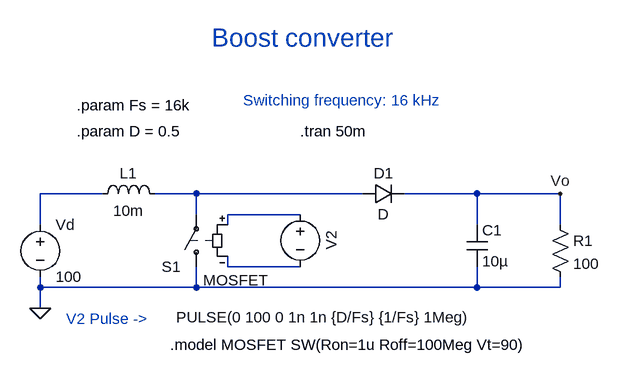
[diagram p0: schematic Boost-converter-1.asc]
Boost-converter-1.asc, the LTspice schematic file:
Version 4.1
SHEET 1 1244 680
WIRE -80 96 -176 96
WIRE 64 96 0 96
WIRE 320 96 64 96
WIRE 496 96 384 96
WIRE 624 96 496 96
WIRE 64 128 64 96
WIRE 224 128 112 128
WIRE -176 144 -176 96
WIRE 112 144 112 128
WIRE 496 144 496 96
WIRE 624 144 624 96
WIRE 112 208 112 192
WIRE 224 208 112 208
WIRE -176 240 -176 224
WIRE 64 240 64 208
WIRE 64 240 -176 240
WIRE 496 240 496 208
WIRE 496 240 64 240
WIRE 624 240 624 224
WIRE 624 240 496 240
WIRE -176 272 -176 240
FLAG -176 272 0
FLAG 624 96 Vo
SYMBOL voltage -176 128 R0
WINDOW 123 0 0 Left 0
WINDOW 39 0 0 Left 0
SYMATTR InstName Vd
SYMATTR Value 100
SYMBOL diode 320 112 R270
WINDOW 0 32 32 VTop 2
WINDOW 3 0 32 VBottom 2
SYMATTR InstName D1
SYMBOL ind -96 112 R270
WINDOW 0 32 56 VTop 2
WINDOW 3 5 56 VBottom 2
SYMATTR InstName L1
SYMATTR Value 10m
SYMBOL cap 480 144 R0
SYMATTR InstName C1
SYMATTR Value 10µ
SYMBOL res 608 128 R0
SYMATTR InstName R1
SYMATTR Value 100
SYMBOL sw 64 224 R180
WINDOW 3 -111 -5 Left 2
SYMATTR Value MOSFET
SYMATTR InstName S1
SYMBOL voltage 224 112 R0
WINDOW 0 32 56 VTop 2
WINDOW 3 37 190 Bottom 2
WINDOW 123 0 0 Left 0
WINDOW 39 0 0 Left 0
SYMATTR InstName V2
SYMATTR Value PULSE(0 100 0 1n 1n {D/Fs} {1/Fs} 1Meg)
TEXT 224 0 Left 2 !.tran 50m
TEXT 24 328 Left 2 !.model MOSFET SW(Ron=1u Roff=100Meg Vt=90)
TEXT 88 -144 Left 4 ;Boost converter
TEXT -120 -40 Left 2 !.param Fs = 16k
TEXT -120 0 Left 2 !.param D = 0.5
TEXT 136 -48 Left 2 ;Switching frequency: 16 kHz
TEXT -136 288 Left 2 ;V2 Pulse ->

The netlist it stands for:
* Boost-converter-1.asc
Vd N001 0 100
D1 N002 Vo D
L1 N001 N002 10m
C1 Vo 0 10µ
R1 Vo 0 100
S1 0 N002 N003 N004 MOSFET
V2 N003 N004 PULSE(0 100 0 1n 1n {D/Fs} {1/Fs} 1Meg)
.model D D
.lib standard.dio
.tran 50m
.model MOSFET SW(Ron=1u Roff=100Meg Vt=90)
* Boost converter
.param Fs = 16k
.param D = 0.5
* Switching frequency: 16 kHz
* V2 Pulse ->
.backanno
.end